# EasyEDA Pro project OPA541功率放大.eprj

# Schematic Schematic1
Board Name: Board1; Create Date: 2025-03-31; Page Name: P1; Project Name: OPA541功率放大; Schematic Name: Schematic1; Update Date: 2025-03-31; Company: 嘉立创EDA; Page Size: A4; Version: V1.0
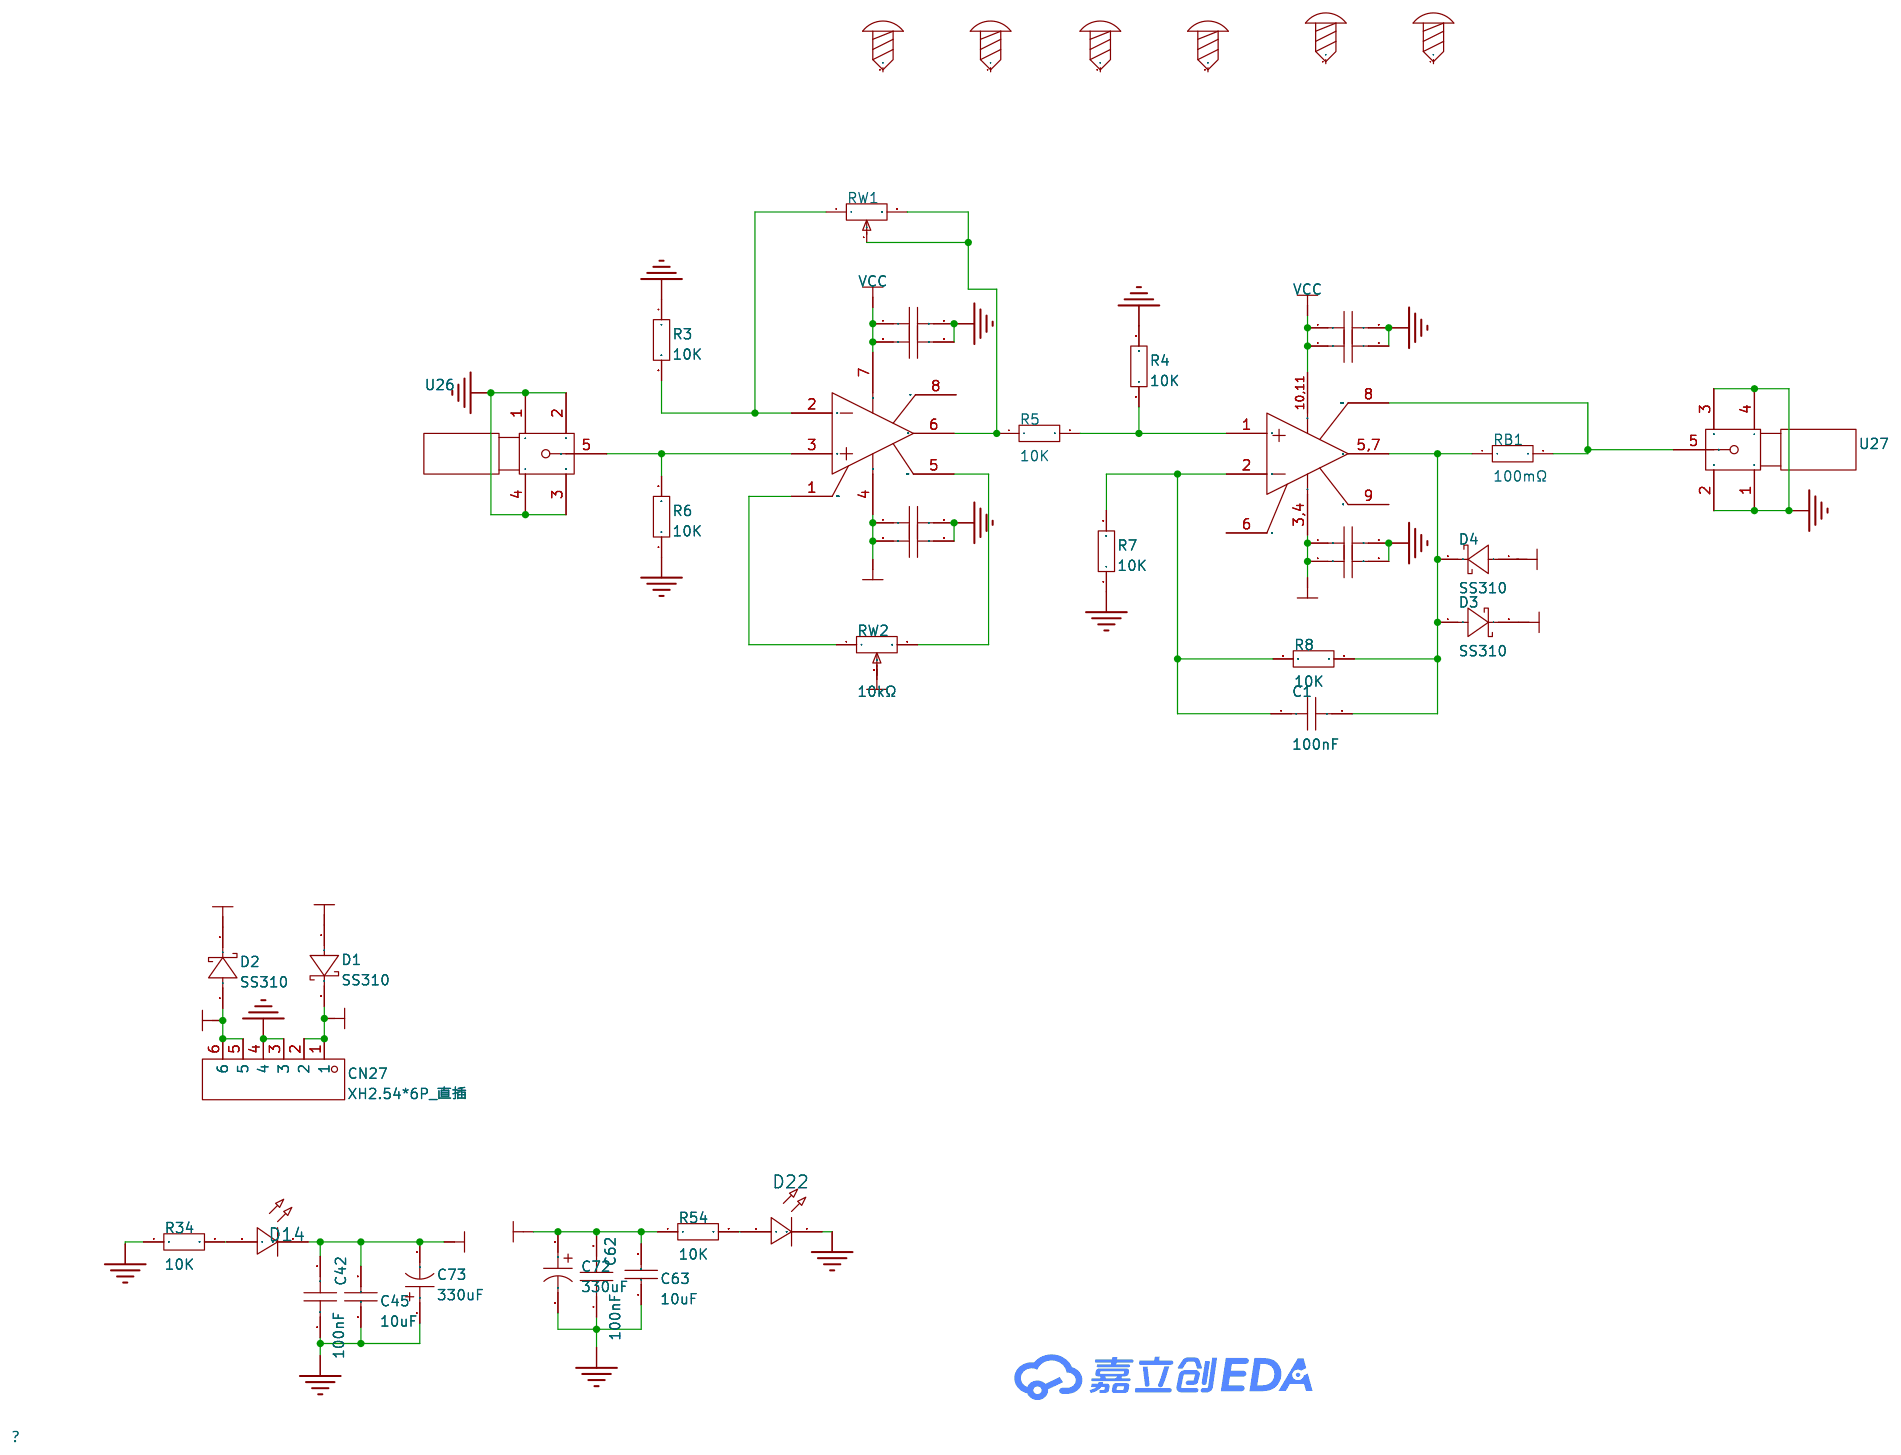
[diagram p0: schematic sheet]

## Parts
C1  100nF  [R0805]
C42  100nF  [R0805]
C45  10uF  [C1210]
C62  100nF  [R0805]
C63  10uF  [C1210]
C64  100nF  [R0805]
C65  100nF  [R0805]
C66  100nF  [R0805]
C67  100nF  [R0805]
C68  100nF  [R0805]
C69  100nF  [R0805]
C70  100nF  [R0805]
C71  100nF  [R0805]
C72  330uF  [CAP-SMD_BD10.0-L10.3-W10.3-LS11.0-FD-1]
C73  330uF  [CAP-SMD_BD10.0-L10.3-W10.3-LS11.0-FD-1]
CN27  XH2.54*6P_直插  [CONN-TH_XH2.54-6P]
D1  SS310  [SMA_L4.3-W2.6-LS5.0-FD]
D2  SS310  [SMA_L4.3-W2.6-LS5.0-FD]
D3  SS310  [SMA_L4.3-W2.6-LS5.0-FD]
D4  SS310  [SMA_L4.3-W2.6-LS5.0-FD]
D14  -  [LED_0805]
D22  -  [LED_0805]
R3  10K  [R0805]
R4  10K  [R0805]
R5  10K  [R0805]
R6  10K  [R0805]
R7  10K  [R0805]
R8  10K  [R0805]
R34  10K  [R0805]
R54  10K  [R0805]
RB1  100mΩ  [RES-TH_L13.0-W9.5-P4.50-D0.7]
RW1  10kΩ  [R_3296]
RW2  10kΩ  [R_3296]
SCREW1  -  [M3螺丝]
SCREW2  -  [M3螺丝]
SCREW3  -  [M3螺丝]
SCREW4  -  [M3螺丝]
SCREW5  -  [M3螺丝]
SCREW6  -  [M3螺丝]
U1  OPA541AP  [TO-220-11_L20.0-W4.5-P1.70-BL]
U2  OPA445AU/2K5  [SOIC-8_L4.9-W3.9-P1.27-LS6.0-BL]
U26  -  [SMA]
U27  -  [SMA]

## Library data of the parts
C1 C42 C62 C64-C71 = CAP_0805: Supplier Footprint: 0805
C45 C63 = CL32B106KAJNNNE: 容值:10uF;精度:±10%;额定电压:25V;材质(温度系数):X7R;; LCSC Part Name: 10uF ±10% 25V; Supplier Part: C39232; Manufacturer: SAMSUNG(三星); Supplier Footprint: 1210; JLCPCB Part Class: 扩展库; Datasheet: https://atta.szlcsc.com/upload/public/pdf/source/20160218/1457707763339.pdf; Supplier: LCSC; Tolerance: ±10%; Voltage Rated: 25V; Temperature Coefficient: X7R
C72 C73 = CS1H331M-CRG10: LCSC Part Name: 330uF ±20% 50V; Supplier Part: C5162354; Manufacturer: ROQANG(容强); Supplier Footprint: SMD,D10xL10.5mm; JLCPCB Part Class: Extended Part; Datasheet: https://atta.szlcsc.com/upload/public/pdf/source/20220927/52139F788102C102FF23EEBD5B52D2E2.pdf; Supplier: LCSC; Tolerance: ±20%; Voltage Rating: 50V; Ripple Current: 285mA@120Hz; Diameter: 10mm; Height - Seated (Max): 10.5mm; Lifetime: 2000hrs@105℃; Operating Temperature: -40℃~+105℃
CN27 = XH2.54*6P_直插: Supplier Part: C9900008614; Supplier Footprint: XH2.54_6P; JLCPCB Part Class: 扩展库; Supplier: LCSC
D1-D4 = SS310_C7420364: LCSC Part Name: 电压:100V 电流:3A; Supplier Part: C7420364; Manufacturer: 宏迦橙; Supplier Footprint: SMA(DO-214AC); JLCPCB Part Class: 扩展库; Datasheet: https://atta.szlcsc.com/upload/public/pdf/source/20230828/75438452AEE6C276EDA92B2AF599BE05.pdf; Supplier: LCSC; Diode Configuration: 独立式; Forward Voltage (Vf@If): 850mV@3A; Reverse Voltage (Vr): 100V; Rectified Current: 3A; Reverse Leakage Current (Ir): 50uA@100V
D14 D22 = LED_0805-R: Supplier Footprint: 0805
R3-R8 R34 R54 = Res_0805: Supplier Footprint: 0805
RB1 = CR-M5W-0.1ΩJ: LCSC Part Name: 水泥电阻 100mΩ ±5% 5W; Supplier Part: C714791; Manufacturer: 华星机电; Supplier Footprint: 插件,P=4.5mm; JLCPCB Part Class: 扩展库; Datasheet: https://atta.szlcsc.com/upload/public/pdf/source/20200731/C714772_2BC325F6EB9D2F2E5702F18F92F88863.pdf; Supplier: LCSC; Type: 水泥电阻; Tolerance: ±5%; Overload Voltage (Max): 750V; Power(Watts): 5W; Temperature Coefficient: -1500ppm/℃~+300ppm/℃; Operating Temperature Range: -55℃~+250℃
RW1 RW2 = R_3296: Supplier Footprint: 直插
SCREW1-SCREW6 = M3螺丝: Supplier Footprint: 插件
U1 = OPA541AP: 放大器数:单路;增益带宽积(GBP):1.6MHz;输入偏置电流(Ib):4pA;压摆率(SR):10V/us;轨到轨:-;; LCSC Part Name: OPA541AP 高功率; Supplier Part: C15537; Manufacturer: TI(德州仪器); Supplier Footprint: TO-220-11(Forming); JLCPCB Part Class: 扩展库; Datasheet: https://www.ti.com/cn/lit/gpn/opa541; Supplier: LCSC; Number of Channels: 单路; Gain Bandwidth Product: 1.6MHz; Ib - Input Bias Current: 4pA; Slew Rate: 10V/us; Output Current: 10A; Quiescent Current per Amplifier: 20mA; Operating Temperature: -25℃~+85℃
U2 = OPA445: OPA445 高电压 FET 输入运算放大器; Supplier Part: C1348606; Manufacturer: TI(德州仪器); Supplier Footprint: SOIC-8; JLCPCB Part Class: 扩展库; Datasheet: https://www.ti.com/cn/lit/gpn/opa445; Supplier: LCSC
U26 U27 = SMA

## Nets
GND: C42.1 C45.1 C62.1 C63.1 C64.2 C65.2 C66.2 C67.2 C68.2 C69.2 C70.2 C71.2 C72.2 C73.1 CN27.3 CN27.4 D22.1(C) R3.1 R4.2 R6.1 R7.1 R34.1 U26.1 U26.2 U26.3 U26.4 U27.1 U27.2 U27.3 U27.4
VCC: C62.2 C63.2 C64.1 C65.1 C68.1 C69.1 C72.1 D2.2(K) R54.1 U1.10,11(V+) U2.7(VCC+)
VCCI: CN27.5 CN27.6 D2.1(A) D3.2(K)
VDD: C42.2 C45.2 C66.1 C67.1 C70.1 C71.1 C73.2 D1.1(A) D14.1(C) RW2.2 U1.3,4(V-) U2.4(VCC-)
VDDI: CN27.1 CN27.2 D1.2(K) D4.1(A)
$1N795: R6.2 U2.3(IN+) U26.5
$1N1775: RW2.1 U2.1(Offset Trim)
$1N1784: RW2.3 U2.5(Offset Trim)
$1N1811: R3.2 RW1.1 U2.2(IN-)
$1N1824: R5.1 RW1.2 RW1.3 U2.6(OUT)
$1N1847: R4.1 R5.2 U1.1(IN+)
$1N1863: C1.1 R7.2 R8.2 U1.2(IN+)
$1N1903: RB1.2 U1.8(Curent Sence) U27.5
$1N2701: D22.2(A) R54.2
$1N2706: D14.2(A) R34.2
Net-(C1-2): C1.2 D3.1(A) D4.2(K) R8.1 RB1.1 U1.5,7(OUT)

Not connected (* = marked no-connect by the designer): SCREW1 1; SCREW2 1; SCREW3 1; SCREW4 1; SCREW5 1; SCREW6 1; U1 6(NC) 9; U2 8(NC)

# Board PCB1
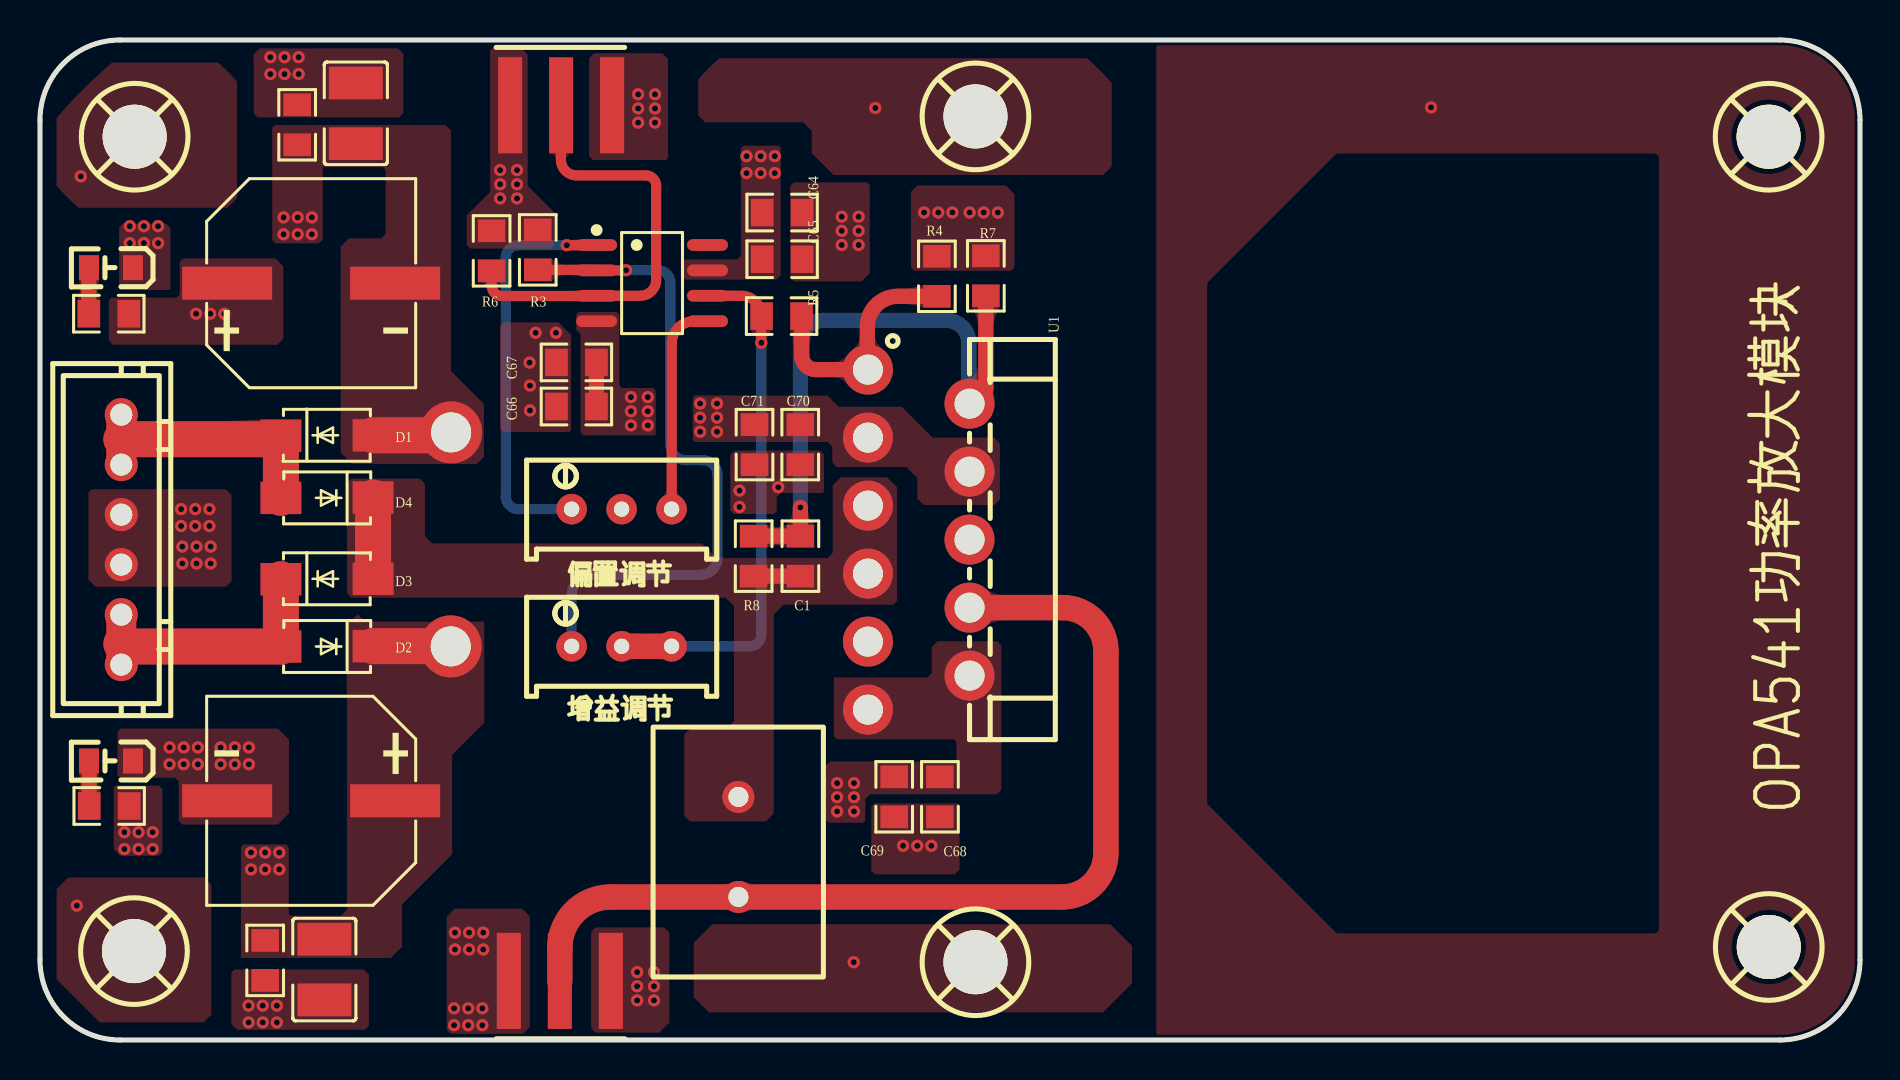
[diagram p1: board, top side]
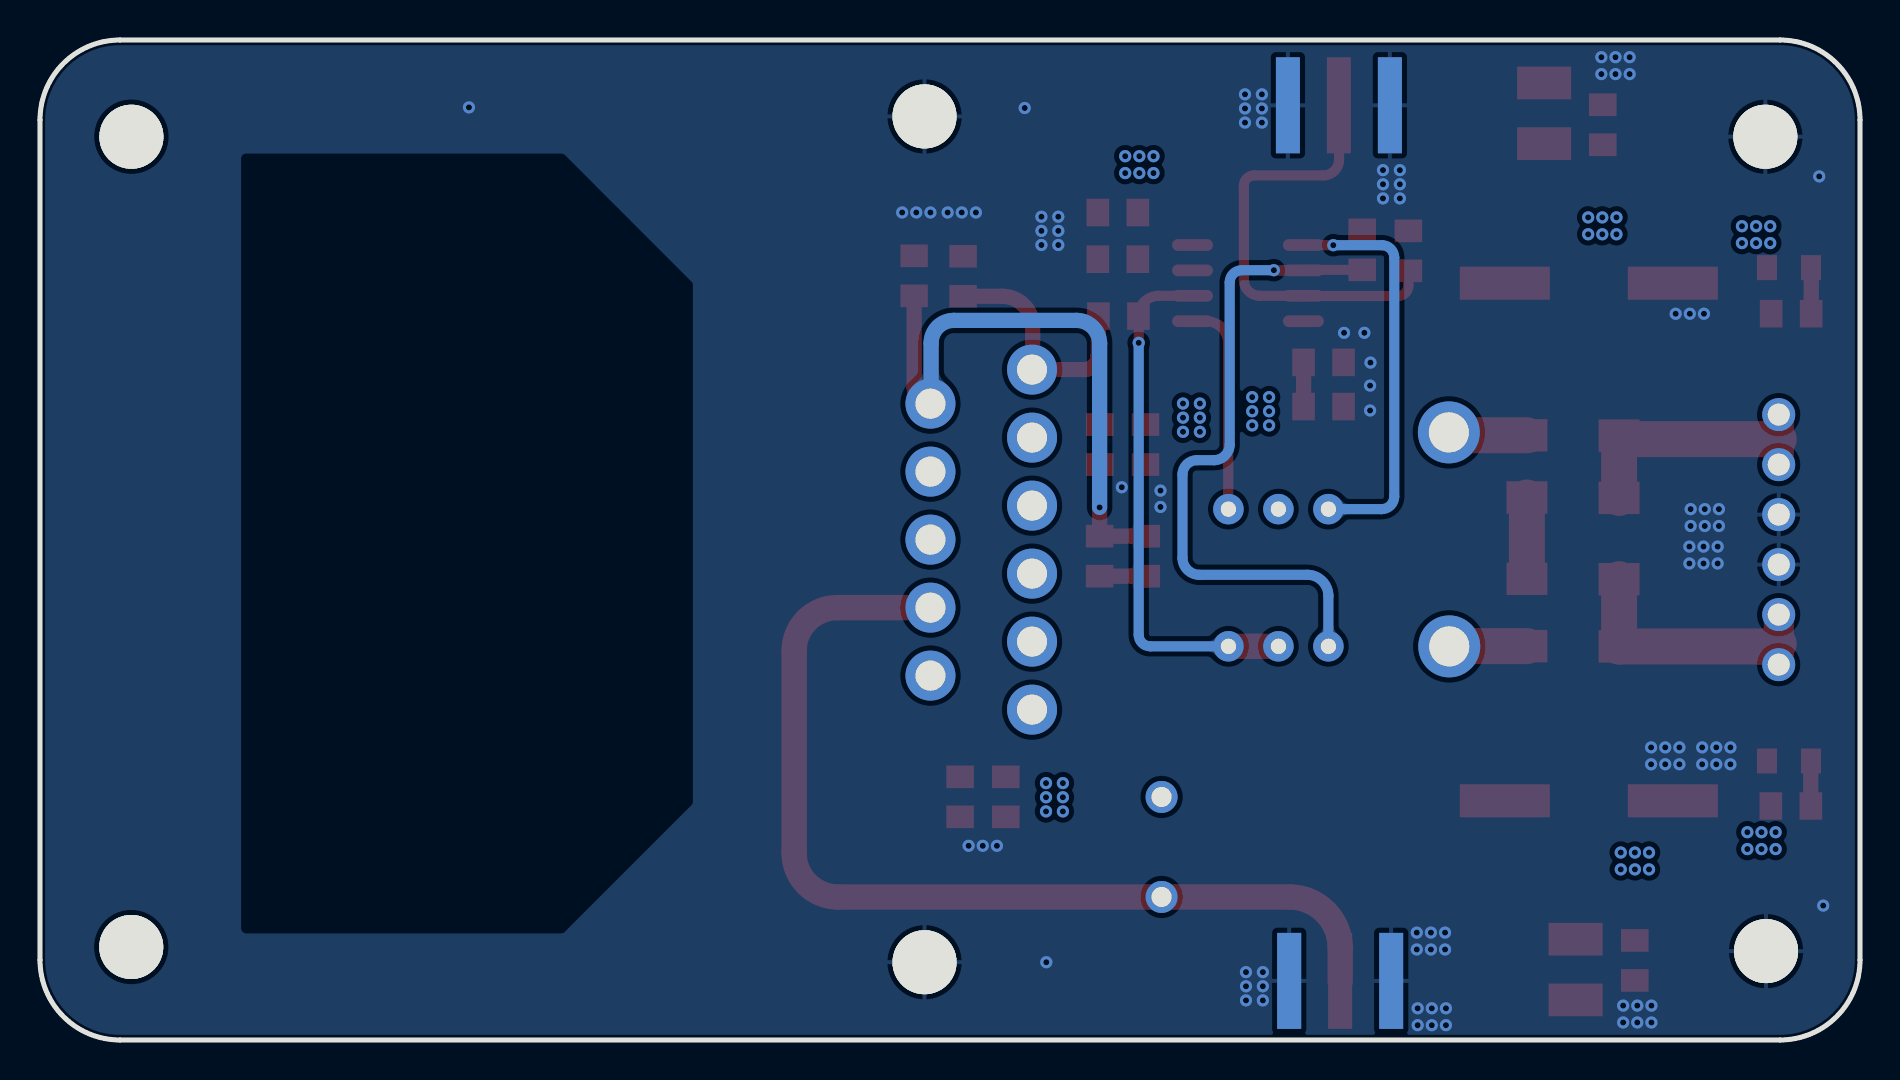
[diagram p2: board, bottom side, seen from below]

Outline 91.01 x 50 mm; copper layers: Top Layer, Inner1, Inner2, Bottom Layer. Coordinates in mm from the lower left corner of the outline.
Outline path: 0,46 0,4 arc(1.17,1.17) 4,0 87.01,0 arc(89.84,1.17) 91.01,4 91.01,46 arc(89.84,48.83) 87.01,50 4,50 arc(1.17,48.83) 0,46
Stack: Top Layer 0.035mm 外层铜厚1oz / Dielectric1 0.2104mm 7628 RC49% 8.6mil / Inner1 0.0152mm 内层铜厚 / Dielectric2 1.065mm 1.1mm H/HOZ Copper / Inner2 0.0152mm 内层铜厚 / Dielectric3 0.2104mm 7628 RC49% 8.6mil / Bottom Layer 0.035mm 外层铜厚1oz

## Design rules (mm)
template: 自定义配置
spacing copperThickness1oz (default): track to track 0.102, other pairs 0.152 to 0.3
spacing copperThickness2oz: track to track 0.203, other pairs 0.152 to 0.3
track width copperThickness1oz (default): min 0.127, default 0.508, max 2.54
track width copperThickness2oz: min 0.203, default 0.254, max 2.54
differential pair differentialPair (default): width min 0.127, default 0.254, max 2.54; gap min 0.152, default 0.152
via viaSize (default): diameter min 0.5, default 0.61, max 10; hole min 0.3, default 0.305, max 6.3

## Placement (name value [footprint] x y rotation side)
C1  100nF  [R0805]  38.02 24.08 270 top
C42  100nF  [R0805]  12.86 45.65 270 top
C45  10uF  [C1210]  15.79 46.33 270 top
C62  100nF  [R0805]  11.26 4.09 90 top
C63  10uF  [C1210]  14.22 3.52 90 top
C64  100nF  [R0805]  37.22 41.37 0 top
C65  100nF  [R0805]  37.22 39.04 0 top
C66  100nF  [R0805]  26.71 31.67 180 top
C67  100nF  [R0805]  26.71 33.88 180 top
C68  100nF  [R0805]  45 12.05 270 top
C69  100nF  [R0805]  42.71 12.05 270 top
C70  100nF  [R0805]  38.01 29.66 270 top
C71  100nF  [R0805]  35.73 29.66 270 top
C72  330uF  [CAP-SMD_BD10.0-L10.3-W10.3-LS11.0-FD-1]  13.56 11.96 180 top
C73  330uF  [CAP-SMD_BD10.0-L10.3-W10.3-LS11.0-FD-1]  13.56 37.84 0 top
CN27  XH2.54*6P_直插  [CONN-TH_XH2.54-6P]  4.06 25.02 270 top
D1  SS310  [SMA_L4.3-W2.6-LS5.0-FD]  14.35 30.23 180 top
D2  SS310  [SMA_L4.3-W2.6-LS5.0-FD]  14.35 19.69 0 top
D3  SS310  [SMA_L4.3-W2.6-LS5.0-FD]  14.35 23.05 180 top
D4  SS310  [SMA_L4.3-W2.6-LS5.0-FD]  14.35 27.12 0 top
D14  -  [LED_0805]  3.5 38.62 180 top
D22  -  [LED_0805]  3.5 13.96 180 top
NOREF  -  [Pad_e65]  20.56 30.38 0 top
NOREF#2  -  [Pad_e80]  20.54 19.68 0 top
R3  10K  [R0805#2]  24.89 39.51 270 top
R4  10K  [R0805#2]  44.85 38.19 90 top
R5  10K  [R0805#2]  37.08 36.19 0 top
R6  10K  [R0805#2]  22.58 39.46 270 top
R7  10K  [R0805#2]  47.3 38.21 270 top
R8  10K  [R0805#2]  35.69 24.19 90 top
R34  10K  [R0805#2]  3.44 36.31 180 top
R54  10K  [R0805#2]  3.46 11.7 180 top
RB1  100mΩ  [RES-TH_L13.0-W9.5-P4.50-D0.7]  34.93 9.65 270 top
RW1  10kΩ  [R_3296]  29.08 19.81 0 top
RW2  10kΩ  [R_3296]  29.08 26.67 0 top
SCREW1  -  [M3螺丝]  86.45 4.65 0 top
SCREW2  -  [M3螺丝]  86.44 45.16 0 top
SCREW3  -  [M3螺丝]  4.73 45.16 0 top
SCREW4  -  [M3螺丝]  4.7 4.44 0 top
SCREW5  -  [M3螺丝]  46.78 46.18 0 top
SCREW6  -  [M3螺丝]  46.78 3.89 0 top
U1  OPA541AP  [TO-220-11_L20.0-W4.5-P1.70-BL]  43.94 25.02 270 top
U2  OPA445AU/2K5  [SOIC-8_L4.9-W3.9-P1.27-LS6.0-BL]  30.61 37.85 270 top
U26  -  [SMA]  20.2 50.55 270 top
U27  -  [SMA]  31.86 -0.85 90 top

## Footprints (pads in the part's own frame, mm; a bottom-side part is the same pattern mirrored in y, then rotated)
C1210
  rect 1.635x2.7 smd: 1(-1.518,0) 2(1.518,0)
CAP-SMD_BD10.0-L10.3-W10.3-LS11.0-FD-1
  rect 4.5x1.65 smd: 1(-4.2,0) 2(4.2,0)
CONN-TH_XH2.54-6P
  round 1.65 hole 1.1: 1(-6.25,0) 2(-3.75,0) 3(-1.25,0) 4(1.25,0) 5(3.75,0) 6(6.25,0)
LED_0805
  rect 1x1.25 smd: 1(-1.15,0.005) 2(1.05,0.005)
M3螺丝
  round 3.2 hole 3.2: 1(0,0)
Pad_e65
  round 3.1 hole 2: 1(0,0)
Pad_e80
  round 3.1 hole 2: 1(0,0)
R0805
  rect 1.133x1.377 smd: 1(-1.111,0) 2(0.889,0)
R0805#2
  rect 1.133x1.377 smd: 1(-1,0) 2(1,0)
R_3296
  round 1.524 hole 0.762: 1(-2.499,-0.127) 2(0,-0.127) 3(2.499,-0.127)
RES-TH_L13.0-W9.5-P4.50-D0.7
  round 1.6 hole 1: 1(-2.5,0) 2(2.5,0)
SMA
  rect 4.8x1.2 smd: 1(3.81,8.412) 2(3.81,3.312) 5(3.81,5.862)
  rect 4.8x1.2 smd far side: 3(3.81,3.312) 4(3.81,8.412)
SMA_L4.3-W2.6-LS5.0-FD
  rect 2.046x1.62 smd: 1(-2.304,-0.009) 2(2.304,0.009)
SOIC-8_L4.9-W3.9-P1.27-LS6.0-BL
  oval 0.588x2.045 smd: 1(-1.905,-2.772) 2(-0.635,-2.772) 3(0.635,-2.772) 4(1.905,-2.772) 5(1.905,2.772) 6(0.635,2.772) 7(-0.635,2.772) 8(-1.905,2.772)
TO-220-11_L20.0-W4.5-P1.70-BL
  round 2.5 hole 1.5: 1(-8.501,-2.54) 2(-6.799,2.54) 3(-5.1,-2.54) 4(-3.401,2.54) 5(-1.7,-2.54) 6(-0.001,2.54) 7(1.7,-2.54) 8(3.401,2.54) 9(5.1,-2.54) 10(6.799,2.54) 11(8.501,-2.54)

## Nets
GND: C42.1 C45.1 C62.1 C63.1 C64.2 C65.2 C66.2 C67.2 C68.2 C69.2 C70.2 C71.2 C72.2 C73.1 CN27.3 CN27.4 D22.1 R3.1 R4.2 R6.1 R7.1 R34.1 SCREW3.1 SCREW4.1 SCREW5.1 SCREW6.1 U26.1 U26.2 U26.3 U26.4 U27.1 U27.2 U27.3 U27.4
VCC: C62.2 C63.2 C64.1 C65.1 C68.1 C69.1 C72.1 D2.2 NOREF#2.1 R54.1 U1.10 U1.11 U2.7
VCCI: CN27.5 CN27.6 D2.1 D3.2
VDD: C42.2 C45.2 C66.1 C67.1 C70.1 C71.1 C73.2 D1.1 D14.1 NOREF.1 RW2.2 U1.3 U1.4 U2.4
VDDI: CN27.1 CN27.2 D1.2 D4.1
$1N795: R6.2 U2.3 U26.5
$1N1775: RW2.1 U2.1
$1N1784: RW2.3 U2.5
$1N1811: R3.2 RW1.1 U2.2
$1N1824: R5.1 RW1.2 RW1.3 U2.6
$1N1847: R4.1 R5.2 U1.1
$1N1863: C1.1 R7.2 R8.2 U1.2
$1N1880: C1.2 D3.1 D4.2 R8.1 RB1.1 U1.5 U1.7
$1N1903: RB1.2 U1.8 U27.5
$1N2701: D22.2 R54.2
$1N2706: D14.2 R34.2

Pads without a net: SCREW1 1; SCREW2 1; U1 6 9; U2 8

## Via types
v1: diameter 0.61, hole 0.305, Top Layer to Bottom Layer, 149 vias

## Routing (per net, layer and track width the routed paths; a pad name or vN(x,y) marks a point on that pad's centre or on a via; arc(x,y) is an arc through that point)
GND:
  vias: v1(1.84,6.72) v1(2.04,43.18) v1(6.48,14.63) v1(6.48,13.79) v1(7.06,26.54) v1(7.06,25.7) v1(7.12,24.67) v1(7.12,23.83) v1(7.19,14.63) v1(7.19,13.79) v1(7.8,36.31) v1(7.76,26.54) v1(7.76,25.7) v1(7.83,24.67) v1(7.83,23.83) v1(7.89,14.63) v1(7.89,13.79) v1(8.51,36.31) v1(8.47,26.54) v1(8.47,25.7) v1(8.53,24.67) v1(8.53,23.83) v1(9.03,14.63) v1(9.03,13.79) v1(9.22,36.31) v1(9.74,14.63) v1(9.74,13.79) v1(10.45,14.63) v1(10.45,13.79) v1(10.43,1.72) v1(10.43,0.88) v1(11.14,1.72) v1(11.14,0.88) v1(11.52,49.14) v1(11.52,48.3) v1(11.84,1.72) v1(11.84,0.88) v1(12.23,49.14) v1(12.23,48.3) v1(12.93,49.14) v1(12.93,48.3) v1(20.71,1.58) v1(20.71,0.74) v1(20.75,5.37) v1(20.75,4.53) v1(21.41,1.58) v1(21.41,0.74) v1(21.46,5.37) v1(21.46,4.53) v1(22.12,1.58) v1(22.12,0.74) v1(22.16,5.37) v1(22.16,4.53) v1(23.01,43.49) v1(23.01,42.79) v1(23.01,42.08) v1(23.85,43.49) v1(23.85,42.79) v1(23.85,42.08) v1(24.48,33.87) v1(24.5,32.72) v1(24.5,31.48) v1(24.78,35.36) v1(25.8,35.36) v1(29.91,47.28) v1(29.91,46.58) v1(29.91,45.87) v1(29.86,3.39) v1(29.86,2.69) v1(29.86,1.98) v1(30.7,3.39) v1(30.7,2.69) v1(30.7,1.98) v1(30.75,47.28) v1(30.75,46.58) v1(30.75,45.87) v1(34.98,27.47) v1(34.98,26.65) v1(36.91,27.64) v1(40.09,41.16) v1(40.09,40.46) v1(40.09,39.75) v1(40.69,3.89) v1(40.93,41.16) v1(40.93,40.46) v1(40.93,39.75) v1(41.77,46.6) v1(43.16,9.71) v1(43.87,9.71) v1(44.21,41.38) v1(44.57,9.71) v1(44.92,41.38) v1(45.62,41.38) v1(46.48,41.38) v1(47.19,41.38) v1(47.9,41.38) v1(69.56,46.63)
VCC: length 3.9
  Top Layer w0.508: 20.53,19.69 arc(20.54,19.69) NOREF#2.1
  Top Layer w1.8: D2.2 20.53,19.69
  vias: v1(4.22,10.39) v1(4.22,9.55) v1(4.93,10.39) v1(4.93,9.55) v1(5.63,10.39) v1(5.63,9.55) v1(10.55,9.37) v1(10.55,8.53) v1(11.26,9.37) v1(11.26,8.53) v1(11.96,9.37) v1(11.96,8.53) v1(35.33,44.19) v1(35.33,43.35) v1(36.04,44.19) v1(36.04,43.35) v1(36.74,44.19) v1(36.74,43.35) v1(39.86,12.84) v1(39.86,12.14) v1(39.86,11.43) v1(40.7,12.84) v1(40.7,12.14) v1(40.7,11.43)
VCCI: length 13.9
  Top Layer w1.5: CN27.5 CN27.6
  Top Layer w1.8: 4.06,19.81 4.2,19.68 D2.1 D3.2
VDD: length 6.2
  Top Layer w0.762: C66.1 C67.1
  Top Layer w1.8: D1.1 20.42,30.24 arc(20.52,30.28) NOREF.1
  vias: v1(4.49,40.69) v1(4.49,39.85) v1(5.2,40.69) v1(5.2,39.85) v1(5.9,40.69) v1(5.9,39.85) v1(12.18,41.13) v1(12.18,40.29) v1(12.89,41.13) v1(12.89,40.29) v1(13.59,41.13) v1(13.59,40.29) v1(29.55,32.14) v1(29.55,31.44) v1(29.55,30.73) v1(30.39,32.14) v1(30.39,31.44) v1(30.39,30.73) v1(33.01,31.82) v1(33.01,31.12) v1(33.01,30.41) v1(33.85,31.82) v1(33.85,31.12) v1(33.85,30.41)
VDDI: length 13.6
  Top Layer w1.27: D1.2 11.87,30.04
  Top Layer w1.5: CN27.1 CN27.2
  Top Layer w1.8: 4.06,30.04 11.87,30.04 12.05,29.87 D4.1
$1N795: length 22.7
  Top Layer w0.508: R6.2 22.58,37.72 arc(22.74,37.35) 23.1,37.2 27.82,37.2 arc(27.83,37.2) U2.3 30.02,37.21 arc(30.58,37.44) 30.81,38 30.81,42.72 arc(30.66,43.08) 30.3,43.23 26.83,43.23 arc(26.28,43.46) 26.05,44.01 26.05,46.73 arc(26.05,46.73) U26.5
$1N1775: length 20.5
  Top Layer w0.508: v1(26.34,39.74) 27.82,39.74 arc(27.83,39.74) U2.1
  Bottom Layer w0.508: RW2.1 23.93,26.54 arc(23.48,26.73) 23.29,27.18 23.29,39.12 arc(23.47,39.56) 23.91,39.74 v1(26.34,39.74)
$1N1784: length 10.7
  Top Layer w0.508: U2.5 32.71,35.94 arc(31.92,35.61) 31.59,34.82 31.59,26.55 arc(31.59,26.55) RW2.3
$1N1811: length 33.4
  Top Layer w0.508: R3.2 27.81,38.51 arc(27.83,38.5) 27.83,38.48 29.3,38.48 arc(29.31,38.48) v1(29.31,38.49)
  Bottom Layer w0.508: v1(29.31,38.49) 30.91,38.49 arc(31.34,38.31) 31.52,37.88 31.52,29.78 arc(31.75,29.22) 32.31,28.99 33.16,28.99 arc(33.67,28.78) 33.88,28.27 33.88,24.11 arc(33.63,23.51) 33.03,23.26 27.64,23.26 arc(26.89,22.95) 26.58,22.2 RW1.1
$1N1824: length 26.8
  Top Layer w0.508: v1(36.07,34.86) 36.07,36.14 arc(36.01,36.3) 35.85,36.36 ; U2.6 35.07,37.21 arc(35.79,36.91) R5.1
  Top Layer w1.27: RW1.2 RW1.3
  Bottom Layer w0.508: RW1.3 35.5,19.69 arc(35.9,19.85) 36.07,20.26 v1(36.07,34.86)
$1N1847: length 12.2
  Top Layer w0.762: R4.1 42.9,37.19 arc(41.82,36.74) 41.37,35.66 41.37,33.55 arc(41.38,33.53) U1.1 38.8,33.52 arc(38.3,33.73) 38.09,34.23 38.09,36.19 arc(38.09,36.19) R5.2
$1N1863: length 30.6
  Top Layer w0.762: R7.2 47.3,32.63 arc(47.06,32.06) U1.2 ; v1(38.02,26.63) C1.1 R8.2
  Bottom Layer w0.762: v1(38.02,26.63) 38.02,34.82 arc(38.36,35.64) 39.18,35.98 45.32,35.98 arc(46.12,35.65) 46.45,34.85 46.45,31.85 arc(46.46,31.83) U1.2
$1N1880: length 6
  Top Layer w0.762: R8.1 C1.2
  Top Layer w1.8: D4.2 16.66,23.44
$1N1903: length 49.8
  Top Layer w1.27: U1.8 51.14,21.62 arc(52.67,20.99) 53.3,19.46 53.3,9.35 arc(52.66,7.79) 51.1,7.15 34.93,7.15 arc(34.93,7.15) RB1.2 28.53,7.15 arc(26.74,6.41) 25.99,4.61 U27.5
$1N2701: length 2.3
  Top Layer w0.762: R54.2 2.46,13.93 arc(2.46,13.94) D22.2
$1N2706: length 2.3
  Top Layer w0.762: R34.2 2.44,38.61 arc(2.44,38.61) D14.2

## Copper pours and planes (outline as drawn; the poured copper is in the pictures)
GND on Top Layer: 55.82,60.71 111.34,60.71 111.34,-14.89 55.82,-14.89
GND on Top Layer: 37.51,42.88 41.49,42.88 41.49,37.93 37.51,37.93
GND on Top Layer: 0.83,48.87 9.85,48.87 9.85,41.61 0.83,41.61
GND on Top Layer: 3.44,39.08 12.17,39.08 12.17,34.76 3.44,34.76
GND on Top Layer: 41.57,11.83 45.98,11.83 45.98,8.28 41.57,8.28
GND on Top Layer: 32.92,49.09 53.59,49.09 53.59,43.25 32.92,43.25
GND on Top Layer: 20.34,6.57 24.49,6.57 24.49,0.31 20.34,0.31
GND on Top Layer: 21.34,49.64 25.72,49.64 25.72,39.57 21.34,39.57
GND on Top Layer: 0.83,8.13 8.57,8.13 8.57,0.88 0.83,0.88
GND on Top Layer: 9.57,3.52 16.45,3.52 16.45,0.51 9.57,0.51
GND on Top Layer: 3.88,15.57 12.45,15.57 12.45,10.77 3.88,10.77
GND on Top Layer: 43.55,42.73 48.73,42.73 48.73,38.46 43.55,38.46
GND on Top Layer: 27.46,49.34 31.4,49.34 31.4,44 27.46,44
GND on Top Layer: 34.5,29.47 39.21,29.47 39.21,26.3 34.5,26.3
GND on Top Layer: 32.69,5.79 54.61,5.79 54.61,1.38 32.69,1.38
GND on Top Layer: 2.42,27.54 9.58,27.54 9.58,22.66 2.42,22.66
GND on Top Layer: 10.68,49.58 18.17,49.58 18.17,46.13 10.68,46.13
GND on Top Layer: 27.56,5.63 31.47,5.63 31.47,0.37 27.56,0.37
GND on Top Layer: 23.01,35.88 26.56,35.88 26.56,30.4 23.01,30.4
GND on Bottom Layer: -11.55,62.61 100.12,62.61 100.12,-12.3 -11.55,-12.3
GND on Inner1: 0.26,49.74 90.75,49.74 90.75,0.26 0.26,0.26
GND on Inner2: 0.26,49.74 90.75,49.74 90.75,0.26 0.26,0.26
VCC on Top Layer: 32.13,44.71 37.04,44.71 37.04,38.02 32.13,38.02
VCC on Top Layer: 39.28,19.94 48.07,19.94 48.07,10.86 39.28,10.86
VCC on Top Layer: 3.68,12.72 6.12,12.72 6.12,9.21 3.68,9.21
VCC on Top Layer: 10.05,21.28 22.22,21.28 22.22,4.1 10.05,4.1
VCC on Inner2: 3.02,45.78 55.31,45.78 55.31,8.39 3.02,8.39
VDD on Top Layer: 32.64,32.23 48,32.23 48,26.75 32.64,26.75
VDD on Top Layer: 3.96,40.81 6.52,40.81 6.52,37.5 3.96,37.5
VDD on Top Layer: 26.81,36.4 30.79,36.4 30.79,30.23 26.81,30.23
VDD on Top Layer: 11.61,45.75 22.2,45.75 22.2,28.8 11.61,28.8
VDD on Inner2: 28.19,26.05 29.97,26.05 29.97,24.19 28.19,24.19
VDD on Inner2: 3.77,41.19 36.91,41.19 36.91,27.03 3.77,27.03
$1N1880 on Top Layer: 15.35,28.14 42.86,28.14 42.86,10.93 15.35,10.93

Small or netless copper shapes (teardrops, artwork), in the pictures only: 37 on Top Layer, 7 on Bottom Layer, 24 on Inner1, 26 on Inner2

## Text on the board
Top Silkscreen Layer: 偏置调节 | 增益调节 | OPA541功率放大模块
